# Altium schematic sheet TWO_OUTPORT.SchDoc
size A3
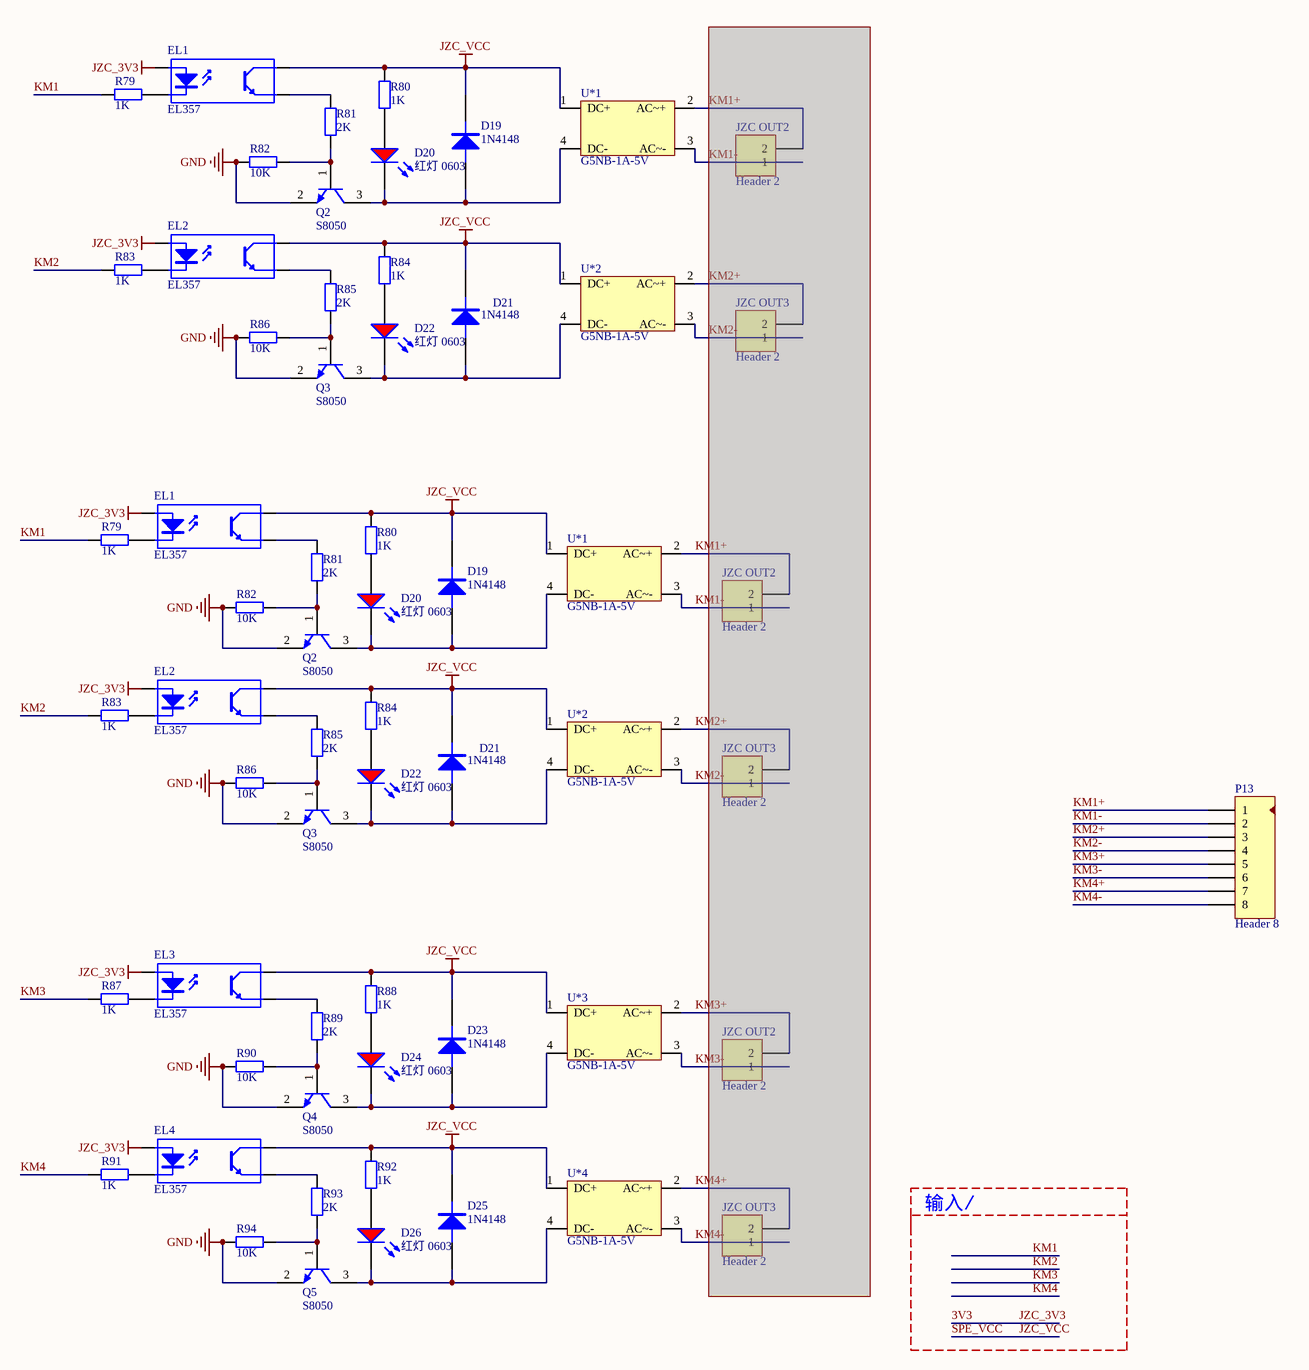
[diagram p0: TWO_OUTPORT.SchDoc]

## Parts
(Parts that share a designator on the sheet are numbered #1, #2 ... from top to bottom, then left to right.)
D19#1  1N4148  [LC-LL-34]
D19#2  1N4148  [LC-LL-34]
D20#1  红灯 0603  [LC-0603_LED_S1]
D20#2  红灯 0603  [LC-0603_LED_S1]
D21#1  1N4148  [LC-LL-34]
D21#2  1N4148  [LC-LL-34]
D22#1  红灯 0603  [LC-0603_LED_S1]
D22#2  红灯 0603  [LC-0603_LED_S1]
D23  1N4148  [LC-LL-34]
D24  红灯 0603  [LC-0603_LED_S1]
D25  1N4148  [LC-LL-34]
D26  红灯 0603  [LC-0603_LED_S1]
EL1#1  EL357  [lc-sop-4_P2.54]
EL1#2  EL357  [lc-sop-4_P2.54]
EL2#1  EL357  [lc-sop-4_P2.54]
EL2#2  EL357  [lc-sop-4_P2.54]
EL3  EL357  [lc-sop-4_P2.54]
EL4  EL357  [lc-sop-4_P2.54]
JZC_OUT2#1  Header 2  [D5.08-2P]  (masked out: inside a compile mask, not in the netlist)
JZC_OUT2#2  Header 2  [D5.08-2P]  (masked out: inside a compile mask, not in the netlist)
JZC_OUT2#3  Header 2  [D5.08-2P]  (masked out: inside a compile mask, not in the netlist)
JZC_OUT3#1  Header 2  [D5.08-2P]  (masked out: inside a compile mask, not in the netlist)
JZC_OUT3#2  Header 2  [D5.08-2P]  (masked out: inside a compile mask, not in the netlist)
JZC_OUT3#3  Header 2  [D5.08-2P]  (masked out: inside a compile mask, not in the netlist)
P13  Header 8  [5.08-8p]
Q2#1  S8050  [LC-SOT-23(SOT-23-3)]
Q2#2  S8050  [LC-SOT-23(SOT-23-3)]
Q3#1  S8050  [LC-SOT-23(SOT-23-3)]
Q3#2  S8050  [LC-SOT-23(SOT-23-3)]
Q4  S8050  [LC-SOT-23(SOT-23-3)]
Q5  S8050  [LC-SOT-23(SOT-23-3)]
R79#1  1K  [LC-0603_R]
R79#2  1K  [LC-0603_R]
R80#1  1K  [LC-0603_R]
R80#2  1K  [LC-0603_R]
R81#1  2K  [LC-0603_R]
R81#2  2K  [LC-0603_R]
R82#1  10K  [LC-0603_R]
R82#2  10K  [LC-0603_R]
R83#1  1K  [LC-0603_R]
R83#2  1K  [LC-0603_R]
R84#1  1K  [LC-0603_R]
R84#2  1K  [LC-0603_R]
R85#1  2K  [LC-0603_R]
R85#2  2K  [LC-0603_R]
R86#1  10K  [LC-0603_R]
R86#2  10K  [LC-0603_R]
R87  1K  [LC-0603_R]
R88  1K  [LC-0603_R]
R89  2K  [LC-0603_R]
R90  10K  [LC-0603_R]
R91  1K  [LC-0603_R]
R92  1K  [LC-0603_R]
R93  2K  [LC-0603_R]
R94  10K  [LC-0603_R]
U*1#1  G5NB-1A-5V  [G5NB-1A-5V]
U*1#2  G5NB-1A-5V  [G5NB-1A-5V]
U*2#1  G5NB-1A-5V  [G5NB-1A-5V]
U*2#2  G5NB-1A-5V  [G5NB-1A-5V]
U*3  G5NB-1A-5V  [G5NB-1A-5V]
U*4  G5NB-1A-5V  [G5NB-1A-5V]

## Nets
3V3: EL1#1.1(A) EL1#2.1(A) EL2#1.1(A) EL2#2.1(A) EL3.1(A) EL4.1(A)  [also labelled JZC_3V3]
GND: Q2#1.2(E) Q2#2.2(E) Q3#1.2(E) Q3#2.2(E) Q4.2(E) Q5.2(E) R82#1.2 R82#2.2 R86#1.2 R86#2.2 R90.2 R94.2
JZC_VCC: D19#1.2(K) D19#2.2(K) D21#1.2(K) D21#2.2(K) D23.2(K) D25.2(K) EL1#1.4(C) EL1#2.4(C) EL2#1.4(C) EL2#2.4(C) EL3.4(C) EL4.4(C) R80#1.1 R80#2.1 R84#1.1 R84#2.1 R88.1 R92.1 U*1#1.1(DC+) U*1#2.1(DC+) U*2#1.1(DC+) U*2#2.1(DC+) U*3.1(DC+) U*4.1(DC+)  [also labelled SPE_VCC]
KM1: R79#1.2 R79#2.2
KM1+: P13.1 U*1#2.2(AC~+)
KM1-: P13.2 U*1#2.3(AC~-)
KM2: R83#1.2 R83#2.2
KM2+: P13.3 U*2#2.2(AC~+)
KM2-: P13.4 U*2#2.3(AC~-)
KM3: R87.2
KM3+: P13.5 U*3.2(AC~+)
KM3-: P13.6 U*3.3(AC~-)
KM4: R91.2
KM4+: P13.7 U*4.2(AC~+)
KM4-: P13.8 U*4.3(AC~-)
NetD19#1_1: D19#1.1(A) D20#1.K Q2#1.3(C) U*1#1.4(DC-)
NetD19#2_1: D19#2.1(A) D20#2.K Q2#2.3(C) U*1#2.4(DC-)
NetD20#1_A: D20#1.A R80#1.2
NetD20#2_A: D20#2.A R80#2.2
NetD21#1_1: D21#1.1(A) D22#1.K Q3#1.3(C) U*2#1.4(DC-)
NetD21#2_1: D21#2.1(A) D22#2.K Q3#2.3(C) U*2#2.4(DC-)
NetD22#1_A: D22#1.A R84#1.2
NetD22#2_A: D22#2.A R84#2.2
NetD23_1: D23.1(A) D24.K Q4.3(C) U*3.4(DC-)
NetD24_A: D24.A R88.2
NetD25_1: D25.1(A) D26.K Q5.3(C) U*4.4(DC-)
NetD26_A: D26.A R92.2
NetEL1#1_2: EL1#1.2(K) R79#1.1
NetEL1#1_3: EL1#1.3(E) R81#1.2
NetEL1#2_2: EL1#2.2(K) R79#2.1
NetEL1#2_3: EL1#2.3(E) R81#2.2
NetEL2#1_2: EL2#1.2(K) R83#1.1
NetEL2#1_3: EL2#1.3(E) R85#1.2
NetEL2#2_2: EL2#2.2(K) R83#2.1
NetEL2#2_3: EL2#2.3(E) R85#2.2
NetEL3_2: EL3.2(K) R87.1
NetEL3_3: EL3.3(E) R89.2
NetEL4_2: EL4.2(K) R91.1
NetEL4_3: EL4.3(E) R93.2
NetQ2#1_1: Q2#1.1(B) R81#1.1 R82#1.1
NetQ2#2_1: Q2#2.1(B) R81#2.1 R82#2.1
NetQ3#1_1: Q3#1.1(B) R85#1.1 R86#1.1
NetQ3#2_1: Q3#2.1(B) R85#2.1 R86#2.1
NetQ4_1: Q4.1(B) R89.1 R90.1
NetQ5_1: Q5.1(B) R93.1 R94.1

Not connected (* = marked no-connect by the designer): U*1#1 2(AC~+) 3(AC~-); U*2#1 2(AC~+) 3(AC~-)

## Notes on the sheet
- 输入/

## Library data of the parts
D19#1 D19#2 D21#1 D21#2 D23 D25 = DIODE
D20#1 D20#2 D22#1 D22#2 D24 D26 = 0603 红灯: 发光二极管; ComponentLink1Description: 供应商链接; ComponentLink1URL: http://www.szlcsc.com/product/details_2659.html; Package: 0603; Supplier: LC; SuppliersPartNumber: C2286
EL1#1 EL1#2 EL2#1 EL2#2 EL3 EL4 = ST188: 反射式光电传感器; Published: 24-Mar-1999; LatestRevisionDate: 04-Mar-2005; LatestRevisionNote: Sch pins 3 & 4 Swapped.; DatasheetDocument: Nov-2003; PackageReference: DIP-4; Publisher: Altium Limited
JZC_OUT2#1-JZC_OUT2#3 JZC_OUT3#1-JZC_OUT3#3 = Header 2: Header, 2-Pin; LatestRevisionDate: 17-Jul-2002; LatestRevisionNote: Re-released for DXP Platform.; Publisher: Altium Limited
P13 = Head: 接插件; LatestRevisionDate: 17-Jul-2002; LatestRevisionNote: Re-released for DXP Platform.; Publisher: Altium Limited
R79#1 R79#2 R80#1 R80#2 R81#1 R81#2 R82#1 R82#2 R83#1 R83#2 R84#1 R84#2 R85#1 R85#2 R86#1 R86#2 R87-R94 = Res2: Resistor; Published: 8-Jun-2000; LatestRevisionDate: 17-Jul-2002; LatestRevisionNote: Re-released for DXP Platform.; PackageReference: AXIAL-0.4; Publisher: Altium Limited
  R79#1 R79#2 R80#1 R80#2 R83#1 R83#2 R84#1 R84#2 R87 R88 R91 R92: Value: 1K
  R81#1 R81#2 R85#1 R85#2 R89 R93: Value: 2K
  R82#1 R82#2 R86#1 R86#2 R90 R94: Value: 10K